# Altium schematic sheet KSZ8863EthernetSwitch.SchDoc
size 420 x 297 mm; SheetNumber: 13; SheetTotal: 13
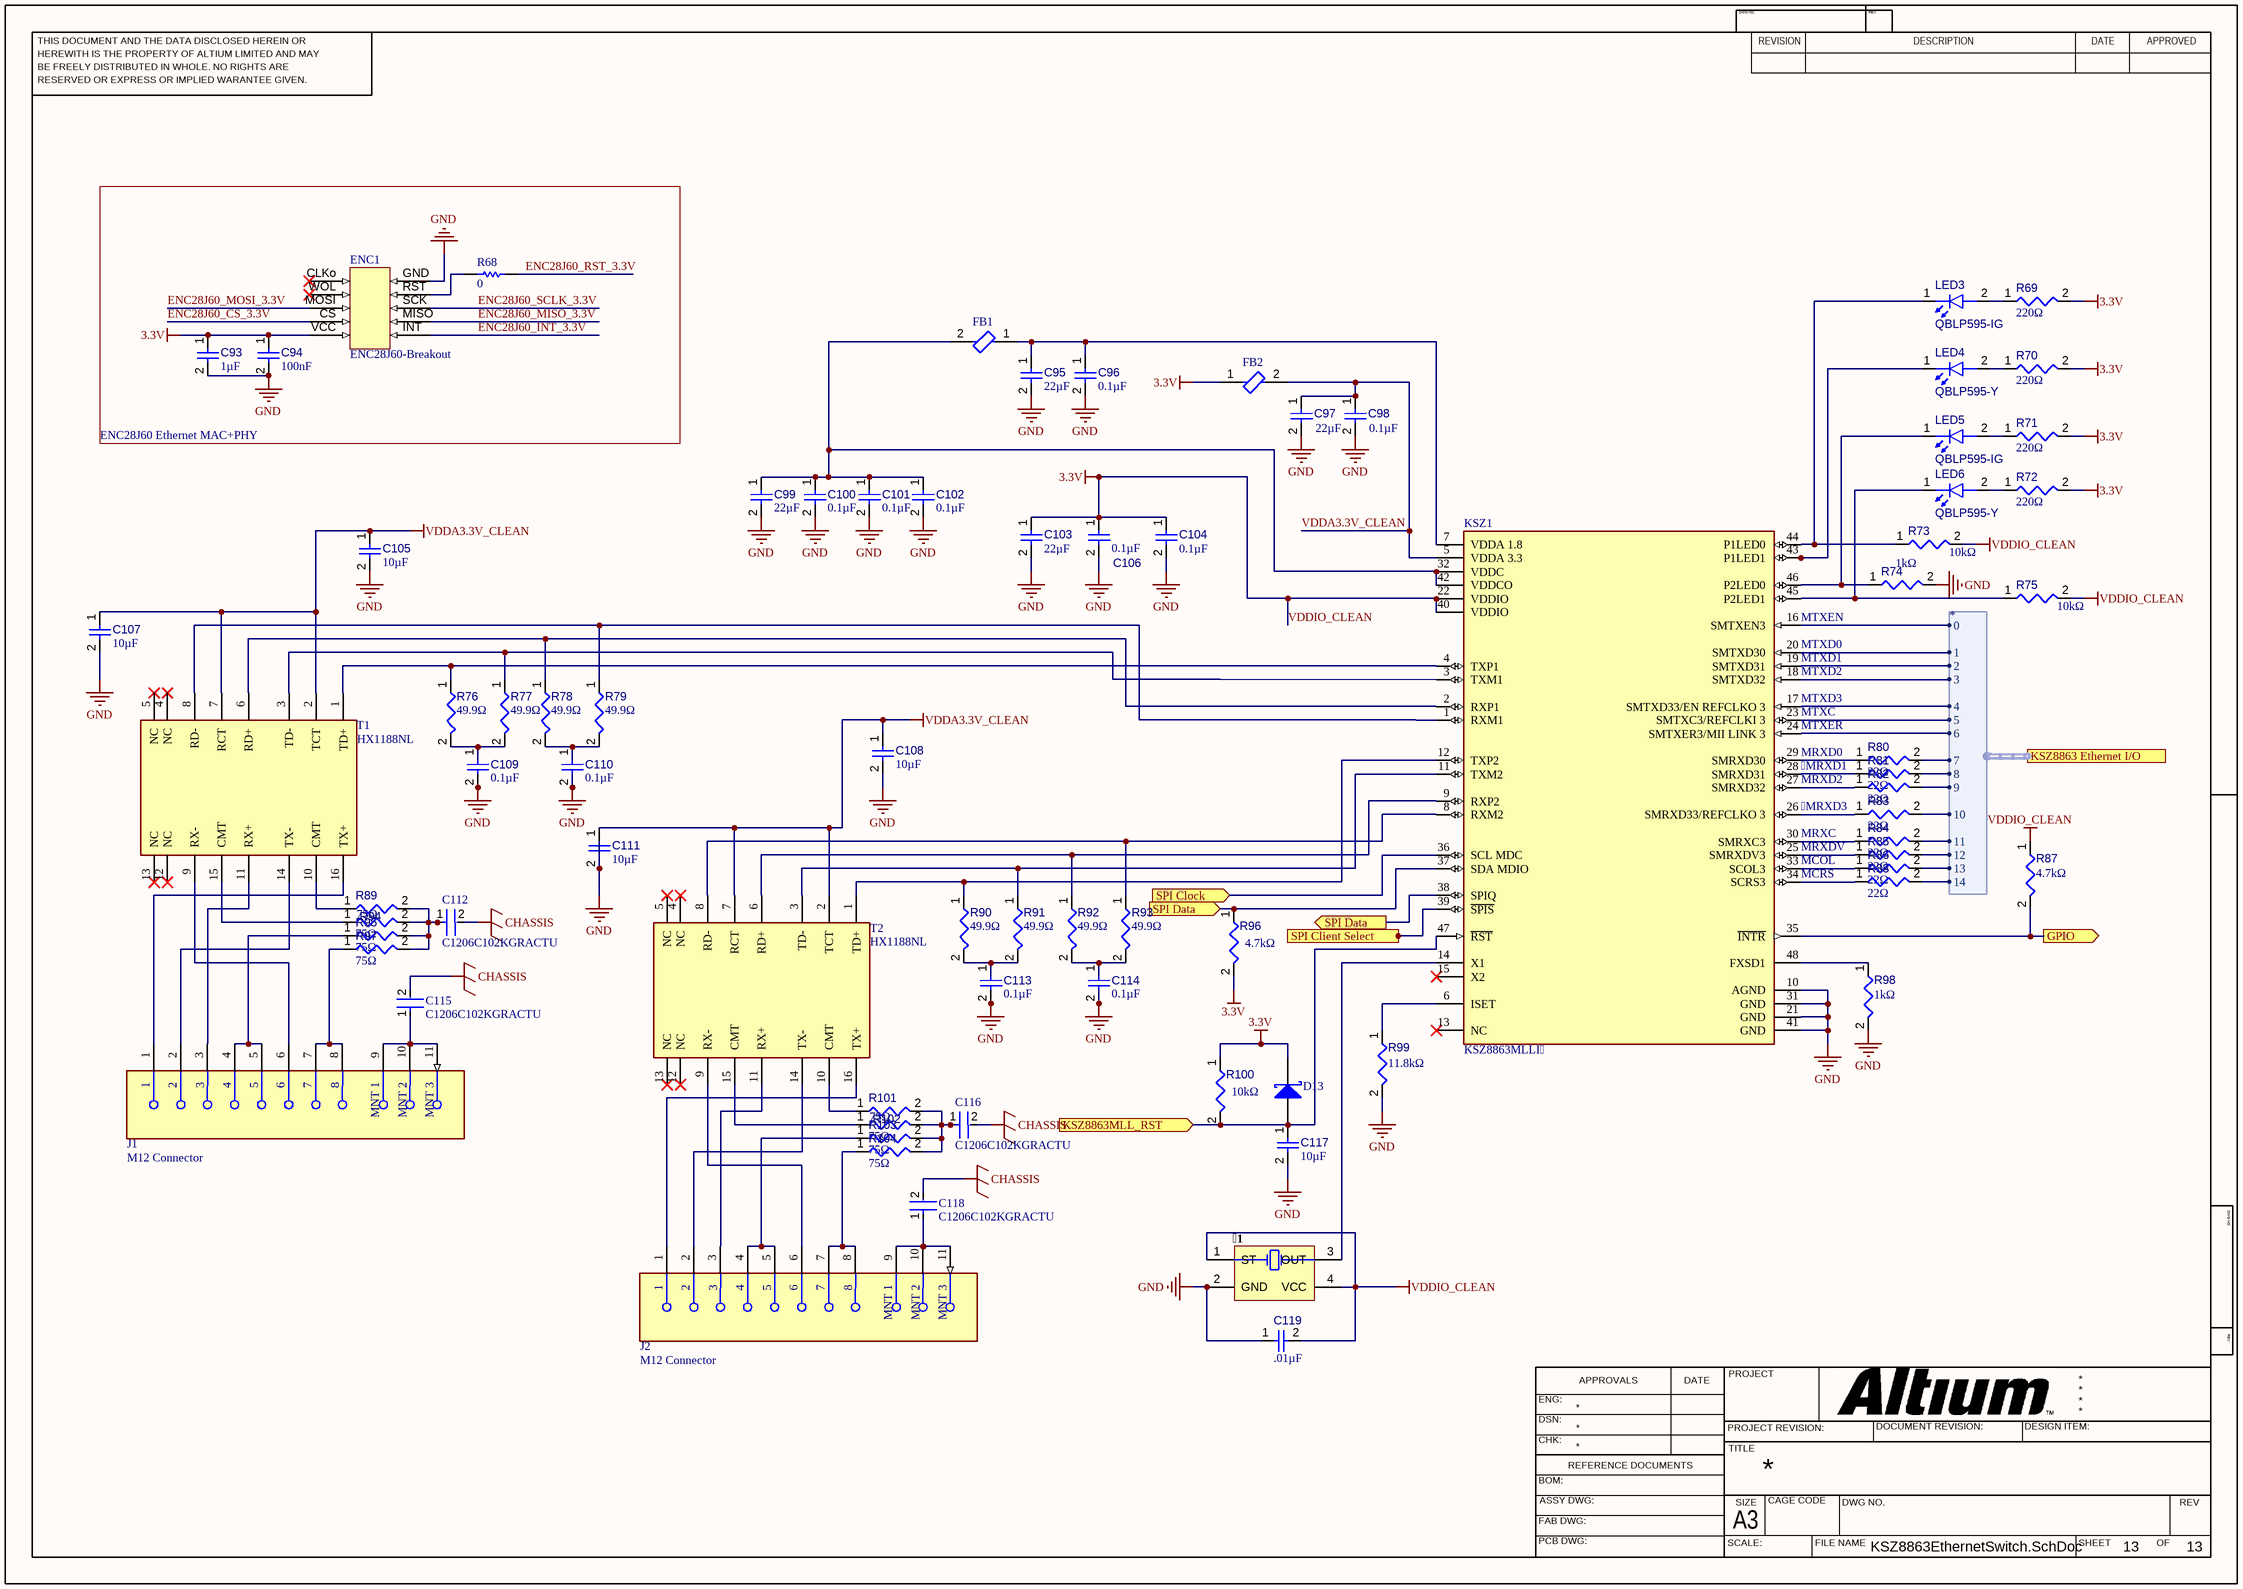
[diagram p0: KSZ8863EthernetSwitch.SchDoc]

## Parts
1  (no value)  [ABRA-ABM3B-4_V]
C93  value 1µF  [CAPC2013X135X45NL10T25]  (hidden comment: Capacitor 1 uF +/- 10% 50 V 0805)
C94  value 100nF  [CAPC2013X95X50LL10T25]  (hidden comment: Capacitor 100 nF +/-10% 50 V 0805)
C95  value 22µF  [CAPC1005X55X25LL05T10]  (hidden comment: Capacitor 1 uF +/- 10% 6.3 V 0402)
C96  value 0.1µF  [CAPC1005X55X25LL05T10]  (hidden comment: Capacitor 1 uF +/- 10% 6.3 V 0402)
C97  value 22µF  [CAPC1005X55X25LL05T10]  (hidden comment: Capacitor 1 uF +/- 10% 6.3 V 0402)
C98  value 0.1µF  [CAPC1005X55X25LL05T10]  (hidden comment: Capacitor 1 uF +/- 10% 6.3 V 0402)
C99  value 22µF  [CAPC1005X55X25LL05T10]  (hidden comment: Capacitor 1 uF +/- 10% 6.3 V 0402)
C100  value 0.1µF  [CAPC1005X55X25LL05T10]  (hidden comment: Capacitor 1 uF +/- 10% 6.3 V 0402)
C101  value 0.1µF  [CAPC1005X55X25LL05T10]  (hidden comment: Capacitor 1 uF +/- 10% 6.3 V 0402)
C102  value 0.1µF  [CAPC1005X55X25LL05T10]  (hidden comment: Capacitor 1 uF +/- 10% 6.3 V 0402)
C103  value 22µF  [CAPC1005X55X25LL05T10]  (hidden comment: Capacitor 1 uF +/- 10% 6.3 V 0402)
C104  value 0.1µF  [CAPC1005X55X25LL05T10]  (hidden comment: Capacitor 1 uF +/- 10% 6.3 V 0402)
C105  value 10µF  [CAPC1005X55X25LL05T10]  (hidden comment: Capacitor 1 uF +/- 10% 6.3 V 0402)
C106  value 0.1µF  [CAPC1005X55X25LL05T10]  (hidden comment: Capacitor 1 uF +/- 10% 6.3 V 0402)
C107  value 10µF  [CAPC1005X55X25LL05T10]  (hidden comment: Capacitor 1 uF +/- 10% 6.3 V 0402)
C108  value 10µF  [CAPC1005X55X25LL05T10]  (hidden comment: Capacitor 1 uF +/- 10% 6.3 V 0402)
C109  value 0.1µF  [CAPC1005X55X25LL05T10]  (hidden comment: Capacitor 1 uF +/- 10% 6.3 V 0402)
C110  value 0.1µF  [CAPC1005X55X25LL05T10]  (hidden comment: Capacitor 1 uF +/- 10% 6.3 V 0402)
C111  value 10µF  [CAPC1005X55X25LL05T10]  (hidden comment: Capacitor 1 uF +/- 10% 6.3 V 0402)
C112  C1206C102KGRACTU  [FP-C1206C-EF-MFG]
C113  value 0.1µF  [CAPC1005X55X25LL05T10]  (hidden comment: Capacitor 1 uF +/- 10% 6.3 V 0402)
C114  value 0.1µF  [CAPC1005X55X25LL05T10]  (hidden comment: Capacitor 1 uF +/- 10% 6.3 V 0402)
C115  C1206C102KGRACTU  [FP-C1206C-EF-MFG]
C116  C1206C102KGRACTU  [FP-C1206C-EF-MFG]
C117  value 10µF  [CAPC1005X55X25LL05T10]  (hidden comment: Capacitor 1 uF +/- 10% 6.3 V 0402)
C118  C1206C102KGRACTU  [FP-C1206C-EF-MFG]
C119  value .01µF  [CAPC1005X55X25LL05T10]  (hidden comment: Capacitor 1 uF +/- 10% 6.3 V 0402)
D13  (no value)  [ONSC-AXIAL_LEAD-2-267-05_V]
ENC1  ENC28J60-Breakout  [New footprint 1]
FB1  (no value)  [FP-BLM15-0_05-MFG]
FB2  (no value)  [FP-BLM15-0_05-MFG]
J1  M12 Connector  [FP-1424177-MFG]
J2  M12 Connector  [FP-1424177-MFG]
KSZ1  KSZ8863MLLI  [FP-LQFP7x7-48LD-PL-1-MFG]
LED3  QBLP595-IG  [QTB-QBLP595_V]
LED4  QBLP595-Y  [QTB-QBLP595_V]
LED5  QBLP595-IG  [QTB-QBLP595_V]
LED6  QBLP595-Y  [QTB-QBLP595_V]
R68  value 0  [RESC3216X60X45ML15T20]  (hidden comment: Resistor 0R +/- 5% 1206 250 mW)
R69  value 220Ω  [RESC0402(1005)_L]  (hidden comment: Resistor 100K +/-1 % 0402 63 mW)
R70  value 220Ω  [RESC0402(1005)_L]  (hidden comment: Resistor 100K +/-1 % 0402 63 mW)
R71  value 220Ω  [RESC0402(1005)_L]  (hidden comment: Resistor 100K +/-1 % 0402 63 mW)
R72  value 220Ω  [RESC0402(1005)_L]  (hidden comment: Resistor 100K +/-1 % 0402 63 mW)
R73  value 10kΩ  [RESC0402(1005)_L]  (hidden comment: Resistor 100K +/-1 % 0402 63 mW)
R74  value 1kΩ  [RESC0402(1005)_L]  (hidden comment: Resistor 100K +/-1 % 0402 63 mW)
R75  value 10kΩ  [RESC0402(1005)_L]  (hidden comment: Resistor 100K +/-1 % 0402 63 mW)
R76  value 49.9Ω  [RESC0402(1005)_L]  (hidden comment: Resistor 100K +/-1 % 0402 63 mW)
R77  value 49.9Ω  [RESC0402(1005)_L]  (hidden comment: Resistor 100K +/-1 % 0402 63 mW)
R78  value 49.9Ω  [RESC0402(1005)_L]  (hidden comment: Resistor 100K +/-1 % 0402 63 mW)
R79  value 49.9Ω  [RESC0402(1005)_L]  (hidden comment: Resistor 100K +/-1 % 0402 63 mW)
R80  value 22Ω  [RESC0402(1005)_L]  (hidden comment: Resistor 100K +/-1 % 0402 63 mW)
R81  value 22Ω  [RESC0402(1005)_L]  (hidden comment: Resistor 100K +/-1 % 0402 63 mW)
R82  value 22Ω  [RESC0402(1005)_L]  (hidden comment: Resistor 100K +/-1 % 0402 63 mW)
R83  value 22Ω  [RESC0402(1005)_L]  (hidden comment: Resistor 100K +/-1 % 0402 63 mW)
R84  value 22Ω  [RESC0402(1005)_L]  (hidden comment: Resistor 100K +/-1 % 0402 63 mW)
R85  value 22Ω  [RESC0402(1005)_L]  (hidden comment: Resistor 100K +/-1 % 0402 63 mW)
R86  value 22Ω  [RESC0402(1005)_L]  (hidden comment: Resistor 100K +/-1 % 0402 63 mW)
R87  value 4.7kΩ  [RESC0402(1005)_L]  (hidden comment: Resistor 100K +/-1 % 0402 63 mW)
R88  value 22Ω  [RESC0402(1005)_L]  (hidden comment: Resistor 100K +/-1 % 0402 63 mW)
R89  value 75Ω  [RESC0402(1005)_L]  (hidden comment: Resistor 100K +/-1 % 0402 63 mW)
R90  value 49.9Ω  [RESC0402(1005)_L]  (hidden comment: Resistor 100K +/-1 % 0402 63 mW)
R91  value 49.9Ω  [RESC0402(1005)_L]  (hidden comment: Resistor 100K +/-1 % 0402 63 mW)
R92  value 49.9Ω  [RESC0402(1005)_L]  (hidden comment: Resistor 100K +/-1 % 0402 63 mW)
R93  value 49.9Ω  [RESC0402(1005)_L]  (hidden comment: Resistor 100K +/-1 % 0402 63 mW)
R94  value 75Ω  [RESC0402(1005)_L]  (hidden comment: Resistor 100K +/-1 % 0402 63 mW)
R95  value 75Ω  [RESC0402(1005)_L]  (hidden comment: Resistor 100K +/-1 % 0402 63 mW)
R96  value 4.7kΩ  [RESC0402(1005)_L]  (hidden comment: Resistor 100K +/-1 % 0402 63 mW)
R97  value 75Ω  [RESC0402(1005)_L]  (hidden comment: Resistor 100K +/-1 % 0402 63 mW)
R98  value 1kΩ  [RESC0402(1005)_L]  (hidden comment: Resistor 100K +/-1 % 0402 63 mW)
R99  value 11.8kΩ  [RESC0402(1005)_L]  (hidden comment: Resistor 100K +/-1 % 0402 63 mW)
R100  value 10kΩ  [RESC0402(1005)_L]  (hidden comment: Resistor 100K +/-1 % 0402 63 mW)
R101  value 75Ω  [RESC0402(1005)_L]  (hidden comment: Resistor 100K +/-1 % 0402 63 mW)
R102  value 75Ω  [RESC0402(1005)_L]  (hidden comment: Resistor 100K +/-1 % 0402 63 mW)
R103  value 75Ω  [RESC0402(1005)_L]  (hidden comment: Resistor 100K +/-1 % 0402 63 mW)
R104  value 75Ω  [RESC0402(1005)_L]  (hidden comment: Resistor 100K +/-1 % 0402 63 mW)
T1  HX1188NL  [FP-HX1188NL-MFG]
T2  HX1188NL  [FP-HX1188NL-MFG]

## Blocks framed on the sheet
ENC28J60 Ethernet MAC+PHY: C93 C94 ENC1 R68

## Ports
GPIO (out), KSZ8863 Ethernet I/O (harness *), KSZ8863MLL_RST (in), SPI Client Select, SPI Clock (in), SPI Data (in), SPI Data (out)

## Harnesses
*: 0, 1, 2, 3, 4, 5, 6, 7, 8, 9, 10, 11, 12, 13, 14

## Nets
CHASSIS: C112.2 C115.2 C116.2 C118.2
GND: 1.2(GND) C93.2 C94.2 C95.2 C96.2 C97.2 C98.2 C99.2 C100.2 C101.2 C102.2 C103.2 C104.2 C105.2 C106.2 C107.2 C108.2 C109.2 C110.2 C111.2 C113.2 C114.2 C117.2 C119.1 ENC1.GND KSZ1.10(AGND) KSZ1.21(GND) KSZ1.31(GND) KSZ1.41(GND) R74.2 R98.2 R99.2
VDDA3.3V_CLEAN: C97.1 C98.1 C105.1 C107.1 C108.1 C111.1 FB2.2 KSZ1.5(VDDA_3.3) T1.2(TCT) T1.7(RCT) T2.2(TCT) T2.7(RCT)
VDDIO_CLEAN: 1.1(ST) 1.4(VCC) C93.1 C94.1 C103.1 C104.1 C106.1 C119.2 D13.2(K) ENC1.VCC FB2.1 KSZ1.22(VDDIO) KSZ1.40(VDDIO) R69.2 R70.2 R71.2 R72.2 R73.2 R75.2 R87.1 R96.2 R100.1  [also labelled 3.3V]
ENC28J60_CS_3.3V: ENC1.CS
ENC28J60_INT_3.3V: ENC1.INT
ENC28J60_MISO_3.3V: ENC1.MISO
ENC28J60_MOSI_3.3V: ENC1.MOSI
ENC28J60_RST_3.3V: R68.2
ENC28J60_SCLK_3.3V: ENC1.SCK
GPIO: KSZ1.35(~{INTR}) R87.2 ; port GPIO
KSZ8863MLL_RST: C117.1 D13.1(A) KSZ1.47(~{RST}) R100.2 ; port KSZ8863MLL_RST
SPI Client Select: KSZ1.39(~{SPIS}) ; port SPI Client Select
SPI Clock: KSZ1.36(SCL_MDC) ; port SPI Clock
SPI Data: KSZ1.37(SDA_MDIO) KSZ1.38(SPIQ) R96.1 ; port SPI Data
Net1_3: 1.3(OUT) KSZ1.14(X1)
NetC95_1: C95.1 C96.1 FB1.1 KSZ1.7(VDDA_1.8)
NetC99_1: C99.1 C100.1 C101.1 C102.1 FB1.2 KSZ1.32(VDDC) KSZ1.42(VDDCO)
NetC109_1: C109.1 R76.2 R77.2
NetC110_1: C110.1 R78.2 R79.2
NetC112_1: C112.1 R89.2 R94.2 R95.2 R97.2
NetC113_1: C113.1 R90.2 R91.2
NetC114_1: C114.1 R92.2 R93.2
NetC115_1: C115.1 J1.9(MNT_1) J1.10(MNT_2) J1.11(MNT_3)
NetC116_1: C116.1 R101.2 R102.2 R103.2 R104.2
NetC118_1: C118.1 J2.9(MNT_1) J2.10(MNT_2) J2.11(MNT_3)
NetENC1_RST: ENC1.RST R68.1
NetJ1_1: J1.1 T1.16(TX+)
NetJ1_2: J1.2 T1.14(TX-)
NetJ1_3: J1.3 T1.11(RX+)
NetJ1_4: J1.4 J1.5 R95.1
NetJ1_6: J1.6 T1.9(RX-)
NetJ1_7: J1.7 J1.8 R97.1
NetJ2_1: J2.1 T2.16(TX+)
NetJ2_2: J2.2 T2.14(TX-)
NetJ2_3: J2.3 T2.11(RX+)
NetJ2_4: J2.4 J2.5 R103.1
NetJ2_6: J2.6 T2.9(RX-)
NetJ2_7: J2.7 J2.8 R104.1
NetKSZ1_1: KSZ1.1(RXM1) R79.1 T1.8(RD-)
NetKSZ1_2: KSZ1.2(RXP1) R78.1 T1.6(RD+)
NetKSZ1_3: KSZ1.3(TXM1) R77.1 T1.3(TD-)
NetKSZ1_4: KSZ1.4(TXP1) R76.1 T1.1(TD+)
NetKSZ1_6: KSZ1.6(ISET) R99.1
NetKSZ1_8: KSZ1.8(RXM2) R93.1 T2.8(RD-)
NetKSZ1_9: KSZ1.9(RXP2) R92.1 T2.6(RD+)
NetKSZ1_11: KSZ1.11(TXM2) R91.1 T2.3(TD-)
NetKSZ1_12: KSZ1.12(TXP2) R90.1 T2.1(TD+)
NetKSZ1_16: KSZ1.16(SMTXEN3) ; harness *.0
NetKSZ1_17: KSZ1.17(SMTXD33/EN_REFCLKO_3) ; harness *.4
NetKSZ1_18: KSZ1.18(SMTXD32) ; harness *.3
NetKSZ1_19: KSZ1.19(SMTXD31) ; harness *.2
NetKSZ1_20: KSZ1.20(SMTXD30) ; harness *.1
NetKSZ1_23: KSZ1.23(SMTXC3/REFCLKI_3) ; harness *.5
NetKSZ1_24: KSZ1.24(SMTXER3/MII_LINK_3) ; harness *.6
NetKSZ1_25: KSZ1.25(SMRXDV3) R85.1
NetKSZ1_26: KSZ1.26(SMRXD33/REFCLKO_3) R83.1
NetKSZ1_27: KSZ1.27(SMRXD32) R82.1
NetKSZ1_28: KSZ1.28(SMRXD31) R81.1
NetKSZ1_29: KSZ1.29(SMRXD30) R80.1
NetKSZ1_30: KSZ1.30(SMRXC3) R84.1
NetKSZ1_33: KSZ1.33(SCOL3) R86.1
NetKSZ1_34: KSZ1.34(SCRS3) R88.1
NetKSZ1_43: KSZ1.43(P1LED1) LED4.1(K)
NetKSZ1_44: KSZ1.44(P1LED0) LED3.1(K) R73.1
NetKSZ1_45: KSZ1.45(P2LED1) LED6.1(K) R75.1
NetKSZ1_46: KSZ1.46(P2LED0) LED5.1(K) R74.1
NetKSZ1_48: KSZ1.48(FXSD1) R98.1
NetLED3_2: LED3.2(A) R69.1
NetLED4_2: LED4.2(A) R70.1
NetLED5_2: LED5.2(A) R71.1
NetLED6_2: LED6.2(A) R72.1
NetR80_2: R80.2 ; harness *.7
NetR81_2: R81.2 ; harness *.8
NetR82_2: R82.2 ; harness *.9
NetR83_2: R83.2 ; harness *.10
NetR84_2: R84.2 ; harness *.11
NetR85_2: R85.2 ; harness *.12
NetR86_2: R86.2 ; harness *.13
NetR88_2: R88.2 ; harness *.14
NetR89_1: R89.1 T1.10(CMT)
NetR94_1: R94.1 T1.15(CMT)
NetR101_1: R101.1 T2.10(CMT)
NetR102_1: R102.1 T2.15(CMT)

Not connected (* = marked no-connect by the designer): ENC1 CLKo* WOL*; KSZ1 13(NC)* 15(X2)*; T1 4(NC)* 5(NC)* 12(NC)* 13(NC)*; T2 4(NC)* 5(NC)* 12(NC)* 13(NC)*

## Notes on the sheet
- (near KSZ1) MTXEN
- (near KSZ1) MTXD0
- (near KSZ1) MTXD1
- (near KSZ1) MTXD2
- (near KSZ1) MTXD3
- (near KSZ1) MTXC
- (near KSZ1) MTXER
- MRXD0
- MRXD1
- MRXD2
- MRXD3
- MRXC
- MRXDV
- MCOL
- MCRS
- THIS DOCUMENT AND THE DATA DISCLOSED HEREIN OR
- HEREWITH IS THE PROPERTY OF ALTIUM LIMITED AND MAY
- DWG NO:
- REVISION
- REV:
- DESCRIPTION
- DATE
- APPROVED
- BE FREELY DISTRIBUTED IN WHOLE. NO RIGHTS ARE
- RESERVED OR EXPRESS OR IMPLIED WARANTEE GIVEN.
- ENG:
- APPROVALS
- PROJECT
- DSN:
- CHK:
- REFERENCE DOCUMENTS
- PROJECT REVISION:
- TITLE
- DOCUMENT REVISION:
- DESIGN ITEM:
- BOM:
- FAB DWG:
- PCB DWG:
- ASSY DWG:
- SCALE:
- A3
- SIZE
- CAGE CODE
- FILE NAME
- DWG NO.
- SHEET
- OF
- REV

## Library data of the parts
1 = CMP-003-00019-2: Ceramic SMD Crystal, 24 MHz, +/- 20 ppm, 18 pF, -20 to 70 degC, 4-Pin SMD, RoHS, Tape and Reel; Manufacturer: Abracon; Load Capacitance: 18pF; Frequency Tolerance: 20ppm; ESR: 50; Resistance: 50Ohm; Frequency: 24MHz; Package Quantity: 1000; Packaging: TapeandReel; RoHS Compliant: True; Package Description: 4-Pin Surface Mount Device, Body 5 x 3.2 mm; Mounting Technology: SM; Pins: 4; Datasheet URL: http://www.abracon.com/Resonators/abm3b.pdf; Tolerance: 20ppm; Manufacturer URL: http://www.abracon.com/; Max Operating Temperature: 70°C; Datasheet Version: Aug-15; Min Operating Temperature: -20°C; Package Reference: ABM3B; Case/Package: CSMD
C93 = CMP-001-00007-6: Chip Capacitor, 1 uF, +/- 10%, 50 V, 0805 (2012 Metric); Capacitor Type: Ceramic; Voltage Rating: 50V; Case/Package: 0805; Max Operating Temperature: 125°C; Min Operating Temperature: -55°C; Mounting Technology: SM; Pins: 2; RoHS Compliant: True; Tolerance: 10%
C94 = CMP-001-00018-6: Chip Capacitor, 100 nF, +/- 10%, 50 V, 0805 (2012 Metric); Capacitor Type: Ceramic; Voltage Rating: 50V; Case/Package: 0805; Max Operating Temperature: 125°C; Min Operating Temperature: -55°C; Mounting Technology: SM; Pins: 2; RoHS Compliant: True; Tolerance: 10%
C95-C111 C113 C114 C117 C119 = CMP-001-00008-6: Chip Capacitor, 1 uF, +/- 10%, 6.3 V, 0402 (1005 Metric); Capacitor Type: Ceramic; Voltage Rating: 6.3V; Max Operating Temperature: 85°C; Mounting Technology: SM; Tolerance: 10%; Case/Package: 0402; RoHS Compliant: True; Min Operating Temperature: -55°C; Pins: 2
C112 C115 C116 C118 = CMP-03020-034681-1: CAP CER 1000PF 2KV X7R 1206; Tolerance: 10%; Capacitance: 1nF; Dissipation Factor: 2.5%; Dielectric Material: Ceramic; Voltage Rating (DC): 2.5kV; Voltage: 2kV; REACH SVHC: No SVHC; Height: 1.6mm; Construction: Flat; Case/Package: 1206; Series: C; Mount: Surface Mount; RoHS Compliant: Yes; Package Quantity: 1; Length: 3.2mm; Width: 0.063inch; Voltage Rating: 2kV; Min Operating Temperature: -55°C; Case Code (Metric): 3216; Termination: SMD/SMT; Number of Pins: 2; Case Code (Imperial): 1206; Packaging: Tape and Reel; Dielectric: X7R; Thickness: 0.069inch; Depth: 1.6mm; Radiation Hardening: No; Max Operating Temperature: 125°C
D13 = CMP-004-00008-2: Axial Lead Rectifier, 60 V, 3 A, -65 to 150 degC, 2-Pin DO-201AD, RoHS, Bag; Manufacturer: ON Semiconductor; Forward Current: 3A; Forward Voltage: 1.08V; Peak Reverse Current: 600uA; Max Surge Current: 80A; Package URL: http://www.onsemi.com/pub_link/Collateral/267-05.PDF; Datasheet URL: http://www.onsemi.cn/pub_link/Collateral/MBR350-D.PDF; Package Description: 2-Pin Axial Lead, Dia 5.05 mm, Body Length 8.4 mm; Package Reference: AXIAL_LEAD-2-267-05; Diameter: 5.3mm; Datasheet Version: Rev. 6, 06/2006; Package Quantity: 500; Packaging: Bulk; Manufacturer URL: http://www.onsemi.com/; Pins: 2; Max Operating Temperature: 150°C; Min Operating Temperature: -65°C; Mounting Technology: TH; RoHS Compliant: True; Case/Package: AXIAL_LEAD-2-267-05
ENC1 = CMP-031-00007-1
FB1 FB2 = CMP-0686-00187-4: Chip Ferrite Bead, 0402, 600Ω @ 100MHz, 0.52Ω, 25%, 300mA; DC Resistance-Max: 600mR; Number of Lines: 1; DC Resistance (DCR): 520mR; Shielding: Unshielded; Impedance: 600R; Material: Steel; Frequency: 100MHz; Lead Free: Lead Free; Max DC Current: 300mA; Test Frequency: 100MHz; Depth: 0.55mm; Length: 1mm; Case Code (Imperial): 0402; Packaging: Tape and Reel; Height: 0.5mm; Max Operating Temperature: 125°C; Military Standard: Not; REACH SVHC: No SVHC; Case Code (Metric): 1005; Series: BLM15AG_SN; Core Material: Ferrite; Termination: SMD/SMT; DC Current: 300mA; Package Quantity: 10000; Width: 0.5mm; RoHS Compliant: Yes; Min Operating Temperature: -55°C; Current Rating: 300mA; Case/Package: 0402; Number of Pins: 2; Radiation Hardening: No; Tolerance: 25%; Number of Circuits: 1; Max Current Rating: 300mA
J1 J2 = CMP-09396-000004-1: CONN RCPT FMALE 8POS GOLD SOLDER; Number of Positions: 8; Voltage Rating: 48V; Ratings: IP67; Current Rating: 500mA; Gender: Female; Wire/Cable Diameter: 6mm; Connector Type: Receptacle; Fastening Type: Twist; Packaging: Bulk; Housing Material: Zinc; Contact Plating: Gold; Lead Free: Lead Free; REACH SVHC: No SVHC; Orientation: Straight; Max Operating Temperature: 70°C; Mount: Panel; Number of Contacts: 8; Termination: Solder; Series: PLUSCON; Min Operating Temperature: -40°C; Thread Size: M12; Package Quantity: 20; Contact Gender: Female
KSZ1 = CMP-06281-000028-1: IC ETHERNET SWITCH 3PORT 48-LQFP; Max Supply Voltage: 3.465V; Max Supply Current: 112mA; Nominal Supply Current: 85mA; Interface: I2C; Min Supply Voltage: 1.71V; Number of Functions: 3; Operating Supply Voltage: 3.3V; Number of Transceivers: 1; Data Rate: 100Mbps; Max Operating Temperature: 85°C; Height: 1.3mm; Length: 7.1mm; Min Operating Temperature: -40°C; RoHS Compliant: Yes; Width: 7.1mm; Mount: Surface Mount; Series: -; Package Quantity: 250; Supply Current: 85mA; REACH SVHC: No SVHC; Lead Free: Lead Free; Number of Ports: 3; Number of Pins: 48; Supply Voltage-Nom: 3.3V; Radiation Hardening: No; Packaging: Tray; Case/Package: LQFP
LED3-LED6 = CMP-007-00041-3: Chip LED 0402, Green, 0.02 A, 3.1 to 3.7 V, -40 to 80 degC, 2-Pin SMD, RoHS, Tape and Reel; Case/Package: 0402; Colour: Green; Mounting Technology: SMT; Pins: 2; RoHS Compliant: Yes
R68 = CMP-009-00002-5: Chip Resistor, 0 Ohm, +/- 5%, 0.25 W, -55 to 155 degC, 1206 (3216 Metric); Voltage Rating: 200V; Power: 250mW; Tolerance: 5%; Min Operating Temperature: -55°C; Mounting Technology: SM; Max Operating Temperature: 155°C; Case/Package: 1206; RoHS Compliant: True; Pins: 2
R69-R104 = CMP-009-00168-3: Chip Resistor, 100 kOhms, +/-1 %, 63 mW, -55 to 155 degC, 0402; Tolerance: 1%; Power: 63mW; Max Operating Temperature: 155°C; Min Operating Temperature: -55°C; Pins: 2; Case/Package: 0402
T1 T2 = CMP-2000-05323-2: MODULE XFRMR SGL ETHR LAN 16SOIC; Turns Ratio: 1:1; Insertion Loss: -1dB; Isolation Voltage: 1.5kV; DC Resistance (DCR): 1.5R; Return Loss: -12dB; Shielding: Unshielded; Lead/Base Style: Gull Wing; Series: -; Depth: 9.53mm; Radiation Hardening: No; Height - Seated (Max): 6.22mm; Package Quantity: 40; Mount: Surface Mount; Width: 7.11mm; Lead Free: Lead Free; Number of Pins: 16; RoHS Compliant: Yes; Termination: SMD/SMT; Min Operating Temperature: -40°C; Packaging: Rail/Tube; Height: 5.97mm; Case/Package: Module; Max Operating Temperature: 85°C; Length: 12.7mm